# Altium schematic sheet 避障车控制板.SchDoc: 避障车控制板PCB
size A3; Revision: 1.1
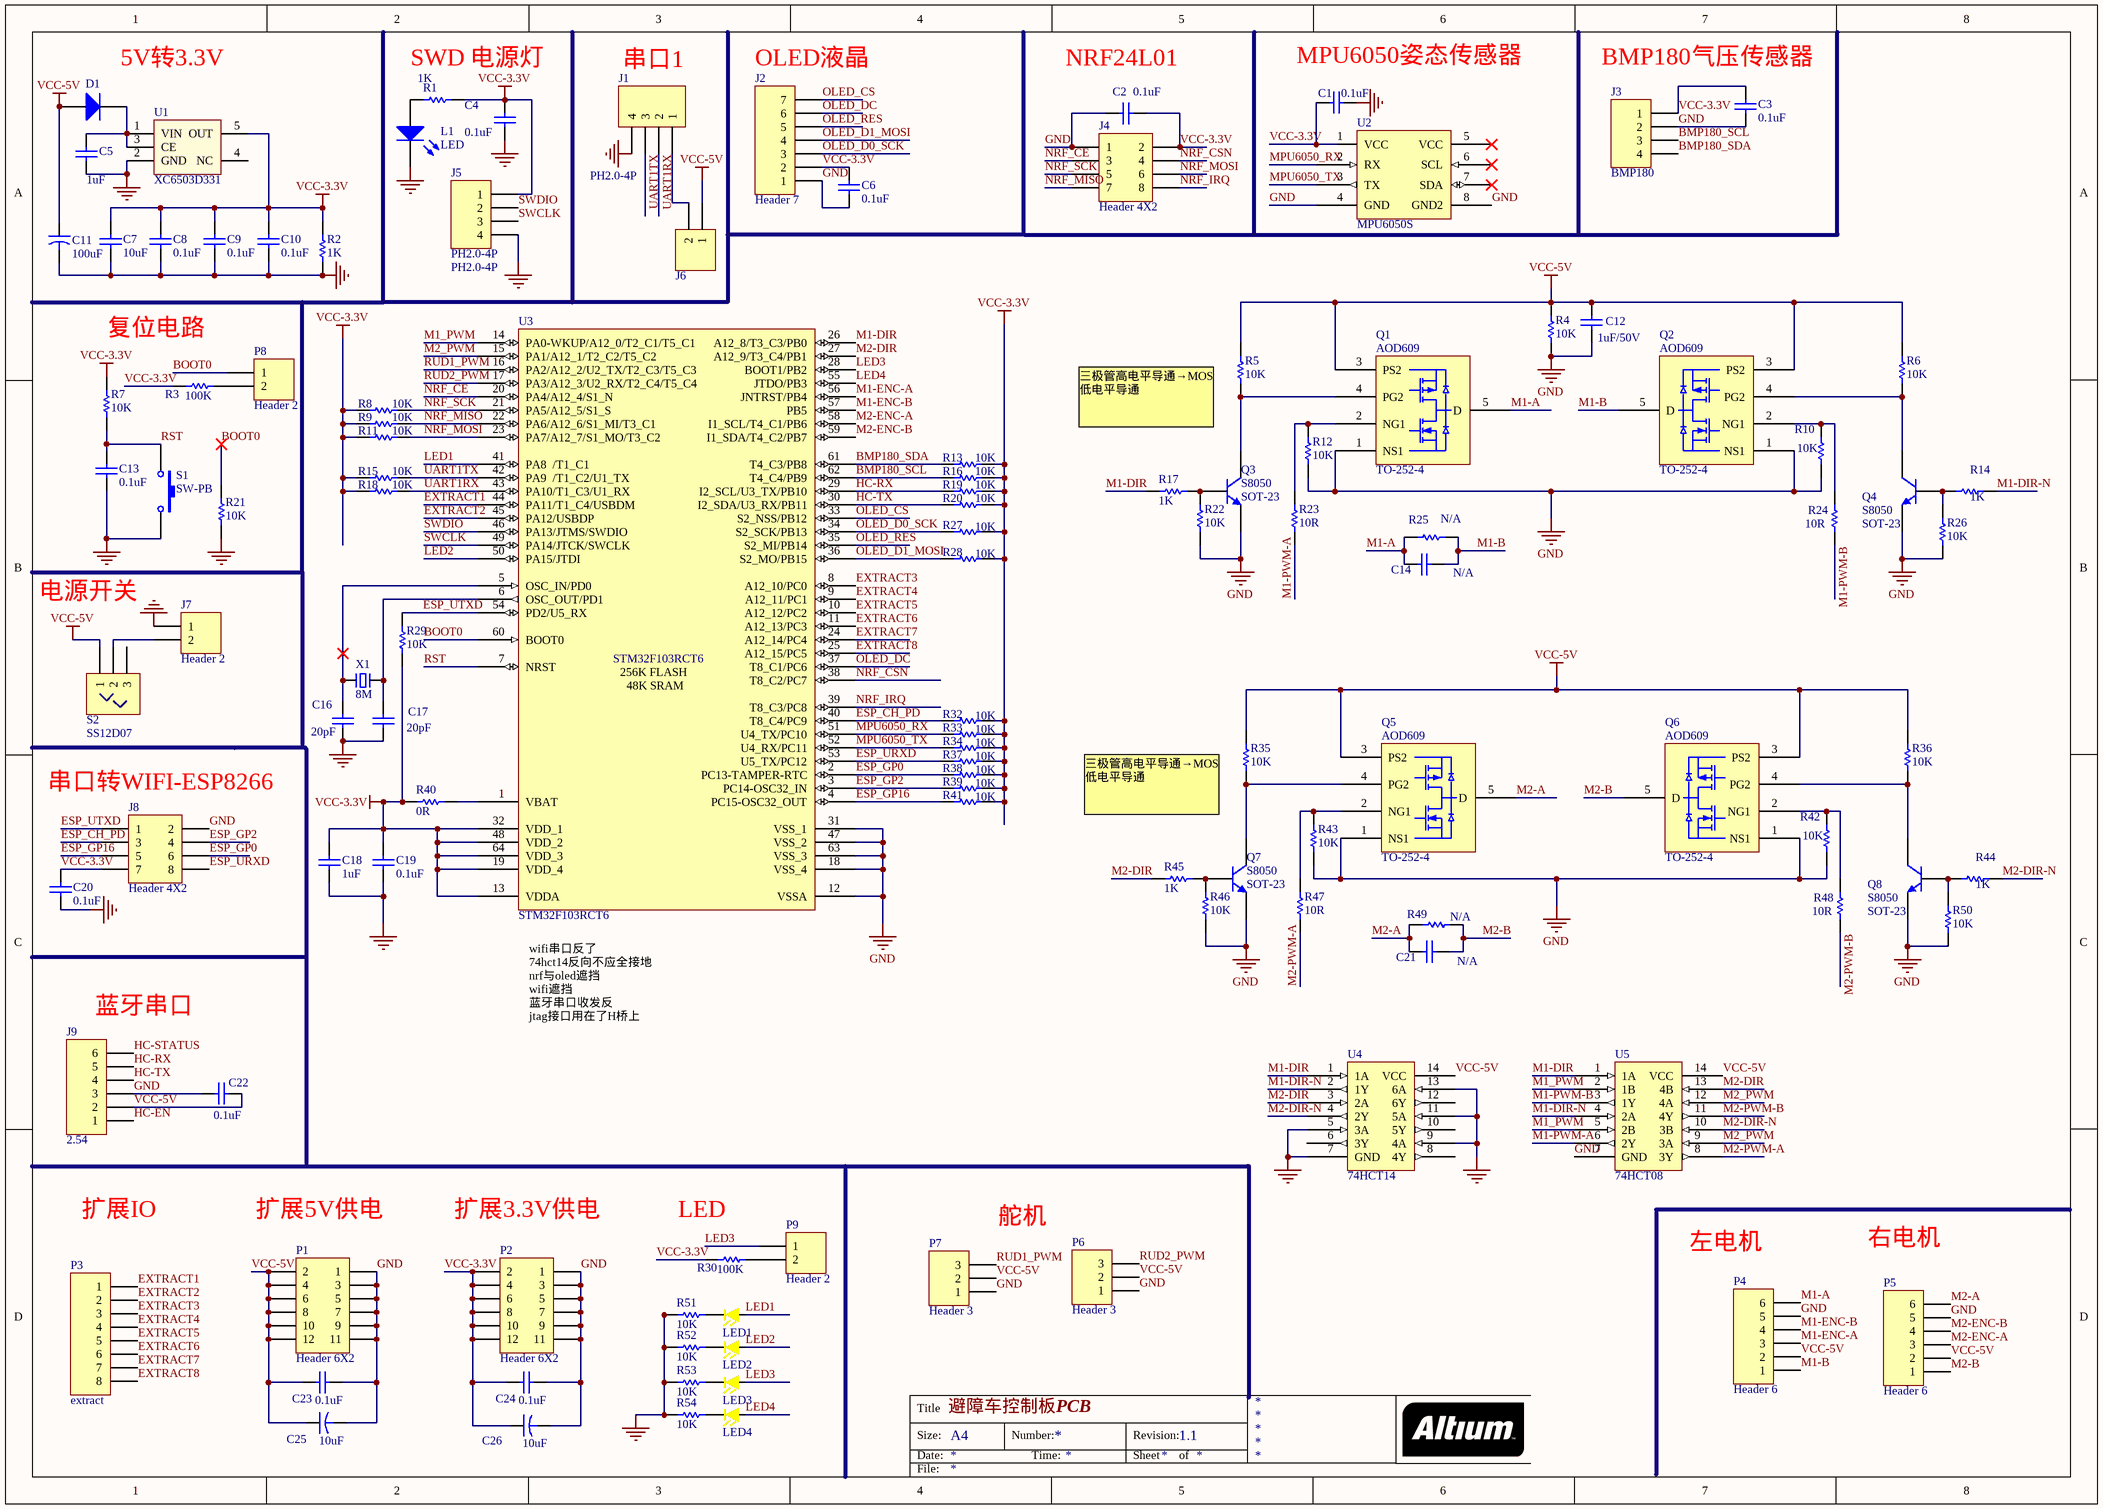
[diagram p0: 避障车控制板.SchDoc]

## Parts
C1  0.1uF  [0805_LY]
C2  0.1uF  [0805_LY]
C3  0.1uF  [0805_LY]
C4  0.1uF  [0805_LY]
C5  1uF  [0805_LY]
C6  0.1uF  [0805_LY]
C7  10uF  [0805_LY]
C8  0.1uF  [0805_LY]
C9  0.1uF  [0805_LY]
C10  0.1uF  [0805_LY]
C11  100uF  [TC6.3*7.7]
C12  1uF/50V  [0805_LY]
C13  0.1uF  [0805_LY]
C14  N/A  [0805_LY]
C16  20pF  [0805_LY]
C17  20pF  [0805_LY]
C18  1uF  [0805_LY]
C19  0.1uF  [0805_LY]
C20  0.1uF  [0805_LY]
C21  N/A  [0805_LY]
C22  0.1uF  [0805_LY]
C23  0.1uF  [0805_LY]
C24  0.1uF  [0805_LY]
C25  10uF  [TC5*5]
C26  10uF  [TC5*5]
D1  SS14  [SMA]  (value not drawn)
J1  value PH2.0-4P  [XH2.54-4P]  (hidden comment: XH2.54-4P)
J2  Header 7  [HDR1X7]
J3  value BMP180  [HDR1X4]  (hidden comment: PH2.0-4P)
J4  Header 4X2  [HDR2X4]
J5  PH2.0-4P  [PH2.0-4P]
J6  XH2.54-2P  [CAP2.54-2P]  (value not drawn)
J7  Header 2  [XH2.54-2P]
J8  Header 4X2  [HDR2X4]
J9  2.54  [HDR1X6]
L1  LED  [0805_LED]
LED1  LED-Y  [0805_LED]  (value not drawn)
LED2  LED-Y  [0805_LED]  (value not drawn)
LED3  LED-Y  [0805_LED]  (value not drawn)
LED4  LED-Y  [0805_LED]  (value not drawn)
P1  Header 6X2  [HDR2X6]
P2  Header 6X2  [HDR2X6]
P3  extract  [HDR1X8]
P4  Header 6  [PH2.0-6p]
P5  Header 6  [PH2.0-6p]
P6  Header 3  [HDR1X3]
P7  Header 3  [HDR1X3]
P8  Header 2  [HDR1X2]
P9  Header 2  [HDR1X2]
Q1  TO-252-4  value AOD609  [TO-252-4L]
Q2  TO-252-4  value AOD609  [TO-252-4L]
Q3  SOT-23  value S8050  [SOT-23_L]
Q4  SOT-23  value S8050  [SOT-23_L]
Q5  TO-252-4  value AOD609  [TO-252-4L]
Q6  TO-252-4  value AOD609  [TO-252-4L]
Q7  SOT-23  value S8050  [SOT-23_L]
Q8  SOT-23  value S8050  [SOT-23_L]
R1  1K  [0805_LY]
R2  1K  [0805_LY]
R3  100K  [6-0805_N]
R4  10K  [0805_LY]
R5  10K  [0805_LY]
R6  10K  [0805_LY]
R7  10K  [0805_LY]
R8  10K  [0805_LY]
R9  10K  [0805_LY]
R10  10K  [0805_LY]
R11  10K  [6-0805_N]
R12  10K  [0805_LY]
R13  10K  [0805_LY]
R14  1K  [0805_LY]
R15  10K  [0805_LY]
R16  10K  [0805_LY]
R17  1K  [0805_LY]
R18  10K  [0805_LY]
R19  10K  [0805_LY]
R20  10K  [0805_LY]
R21  10K  [0805_LY]
R22  10K  [0805_LY]
R23  10R  [0805_LY]
R24  10R  [0805_LY]
R25  N/A  [0805_LY]
R26  10K  [0805_LY]
R27  10K  [0805_LY]
R28  10K  [0805_LY]
R29  10K  [0805_LY]
R30  100K  [6-0805_N]
R32  10K  [0805_LY]
R33  10K  [0805_LY]
R34  10K  [0805_LY]
R35  10K  [0805_LY]
R36  10K  [0805_LY]
R37  10K  [0805_LY]
R38  10K  [0805_LY]
R39  10K  [0805_LY]
R40  0R  [0805_LY]
R41  10K  [0805_LY]
R42  10K  [0805_LY]
R43  10K  [0805_LY]
R44  1K  [0805_LY]
R45  1K  [0805_LY]
R46  10K  [0805_LY]
R47  10R  [0805_LY]
R48  10R  [0805_LY]
R49  N/A  [0805_LY]
R50  10K  [0805_LY]
R51  10K  [0805_LY]
R52  10K  [0805_LY]
R53  10K  [0805_LY]
R54  10K  [0805_LY]
S1  SW-PB  [SW-KEY]
S2  SS12D07  [SS-12D07]
U1  XC6503D331  [SOT23-5]
U2  MPU6050S  [MPU6050S]
U3  STM32F103RCT6  [LQFP64_N]
U4  74HCT14  [SO-14]
U5  74HCT08  [SO-14]
X1  8M  [HC-49SMD]

## Nets
GND: C1.2 C2.2 C3.1 C4.2 C5.1 C6.2 C7.2 C8.2 C9.1 C10.1 C11.2 C12.2 C13.2 C16.1 C17.1 C18.1 C19.1 C20.1 C22.1 C23.2 C24.2 C25.2 C26.2 J1.4 J2.1 J3.2 J4.1 J5.4 J7.1 J8.2 J9.3 L1.2(K) P1.1 P1.3 P1.5 P1.7 P1.9 P1.11 P2.1 P2.3 P2.5 P2.7 P2.9 P2.11 P4.5 P5.5 P6.1 P7.1 Q1.1(NS1) Q2.1(NS1) Q3.2(E) Q4.2(E) Q5.1(NS1) Q6.1(NS1) Q7.2(E) Q8.2(E) R2.1 R4.1 R10.2 R12.2 R21.2 R22.1 R26.2 R42.2 R43.2 R46.1 R50.2 R51.2 R52.2 R53.2 R54.2 S1.2 U1.2(GND) U2.4(GND) U2.8(GND2) U3.12(VSSA) U3.18(VSS_4) U3.31(VSS_1) U3.47(VSS_2) U3.63(VSS_3) U4.5(3A) U4.7(GND) U4.9(4A) U4.11(5A) U4.13(6A) U5.7(GND)
VCC-3.3V: C1.1 C2.1 C3.2 C4.1 C6.1 C7.1 C8.1 C9.2 C10.2 C18.2 C19.2 C20.2 C24.1 C26.1 J2.2 J3.1 J4.2 J5.1 J8.7 P2.2 P2.4 P2.6 P2.8 P2.10 P2.12 R1.2 R2.2 R3.2 R7.1 R8.1 R9.1 R11.1 R13.2 R15.1 R16.2 R18.1 R19.2 R20.2 R27.2 R28.2 R29.1 R30.2 R32.2 R33.2 R34.2 R37.2 R38.2 R39.2 R40.1 R41.2 U1.5(OUT) U2.1(VCC) U3.13(VDDA) U3.19(VDD_4) U3.32(VDD_1) U3.48(VDD_2) U3.64(VDD_3)
VCC-5V: C11.1 C12.1 C22.2 C23.1 C25.1 D1.1(A) J6.1 J9.2 P1.2 P1.4 P1.6 P1.8 P1.10 P1.12 P4.2 P5.2 P6.2 P7.2 Q1.3(PS2) Q2.3(PS2) Q5.3(PS2) Q6.3(PS2) R4.2 R5.2 R6.2 R35.2 R36.2 S2.1 U4.14(VCC) U5.14(VCC)
BMP180_SCL: J3.3 R16.1 U3.62(T4_C4/PB9)
BMP180_SDA: J3.4 R13.1 U3.61(T4_C3/PB8)
BOOT0: P8.1 R21.1 U3.60(BOOT0)
ESP_CH_PD: J8.3 R32.1 U3.40(T8_C4/PC9)
ESP_GP0: J8.6 R38.1 U3.2(PC13-TAMPER-RTC)
ESP_GP2: J8.4 R39.1 U3.3(PC14-OSC32_IN)
ESP_GP16: J8.5 R41.1 U3.4(PC15-OSC32_OUT)
ESP_URXD: J8.8 R37.1 U3.53(U5_TX/PC12)
ESP_UTXD: J8.1 R29.2 U3.54(PD2/U5_RX)
EXTRACT1: P3.1 U3.44(PA11/T1_C4/USBDM)
EXTRACT2: P3.2 U3.45(PA12/USBDP)
EXTRACT3: P3.3 U3.8(A12_10/PC0)
EXTRACT4: P3.4 U3.9(A12_11/PC1)
EXTRACT5: P3.5 U3.10(A12_12/PC2)
EXTRACT6: P3.6 U3.11(A12_13/PC3)
EXTRACT7: P3.7 U3.24(A12_14/PC4)
EXTRACT8: P3.8 U3.25(A12_15/PC5)
HC-EN: J9.1
HC-RX: J9.5 R19.1 U3.29(I2_SCL/U3_TX/PB10)
HC-STATUS: J9.6
HC-TX: J9.4 R20.1 U3.30(I2_SDA/U3_RX/PB11)
LED1: LED1.1 U3.41(PA8__/T1_C1)
LED2: LED2.1 U3.50(PA15/JTDI)
LED3: LED3.1 P9.1 U3.28(BOOT1/PB2)
LED4: LED4.1 U3.55(JTDO/PB3)
M1-A: C14.2 P4.6 Q1.5(D) R25.2
M1-B: C14.1 P4.1 Q2.5(D) R25.1
M1-DIR: R17.2 U3.26(A12_8/T3_C3/PB0) U4.1(1A) U5.1(1A)
M1-DIR-N: R14.1 U4.2(1Y) U5.4(2A)
M1-ENC-A: P4.3 U3.56(JNTRST/PB4)
M1-ENC-B: P4.4 U3.57(PB5)
M1-PWM-A: R23.2 U5.6(2Y)
M1-PWM-B: R24.2 U5.3(1Y)
M1_PWM: U3.14(PA0-WKUP/A12_0/T2_C1/T5_C1) U5.2(1B) U5.5(2B)
M2-A: C21.2 P5.6 Q5.5(D) R49.2
M2-B: C21.1 P5.1 Q6.5(D) R49.1
M2-DIR: R45.2 U3.27(A12_9/T3_C4/PB1) U4.3(2A) U5.13(4B)
M2-DIR-N: R44.1 U4.4(2Y) U5.10(3B)
M2-ENC-A: P5.3 U3.58(I1_SCL/T4_C1/PB6)
M2-ENC-B: P5.4 U3.59(I1_SDA/T4_C2/PB7)
M2-PWM-A: R47.2 U5.8(3Y)
M2-PWM-B: R48.2 U5.11(4Y)
M2_PWM: U3.15(PA1/A12_1/T2_C2/T5_C2) U5.9(3A) U5.12(4A)
MPU6050_RX: R33.1 U2.2(RX) U3.51(U4_TX/PC10)
MPU6050_TX: R34.1 U2.3(TX) U3.52(U4_RX/PC11)
NRF_CE: J4.3 U3.20(PA4/A12_4/S1_N)
NRF_CSN: J4.4 U3.38(T8_C2/PC7)
NRF_IRQ: J4.8 U3.39(T8_C3/PC8)
NRF_MISO: J4.7 R9.2 U3.22(PA6/A12_6/S1_MI/T3_C1)
NRF_MOSI: J4.6 R11.2 U3.23(PA7/A12_7/S1_MO/T3_C2)
NRF_SCK: J4.5 R8.2 U3.21(PA5/A12_5/S1_S)
OLED_CS: J2.7 U3.33(S2_NSS/PB12)
OLED_D0_SCK: J2.3 R27.1 U3.34(S2_SCK/PB13)
OLED_D1_MOSI: J2.4 R28.1 U3.36(S2_MO/PB15)
OLED_DC: J2.6 U3.37(T8_C1/PC6)
OLED_RES: J2.5 U3.35(S2_MI/PB14)
RST: C13.1 R7.2 S1.1 U3.7(NRST)
RUD1_PWM: P7.3 U3.16(PA2/A12_2/U2_TX/T2_C3/T5_C3)
RUD2_PWM: P6.3 U3.17(PA3/A12_3/U2_RX/T2_C4/T5_C4)
SWCLK: J5.3 U3.49(PA14/JTCK/SWCLK)
SWDIO: J5.2 U3.46(PA13/JTMS/SWDIO)
UART1RX: J1.2 R18.2 U3.43(PA10/T1_C3/U1_RX)
UART1TX: J1.3 R15.2 U3.42(PA9__/T1_C2/U1_TX)
NetC5_2: C5.2 D1.2(K) U1.1(VIN) U1.3(CE)
NetC16_2: C16.2 U3.5(OSC_IN/PD0) X1.2
NetC17_2: C17.2 U3.6(OSC_OUT/PD1) X1.1
NetJ1_1: J1.1 J6.2
NetJ7_2: J7.2 S2.2
NetL1_1: L1.1(A) R1.1
NetLED1_2: LED1.2 R51.1
NetLED2_2: LED2.2 R52.1
NetLED3_2: LED3.2 R53.1
NetLED4_2: LED4.2 R54.1
NetP8_2: P8.2 R3.1
NetP9_2: P9.2 R30.1
NetQ1_2: Q1.2(NG1) R12.1 R23.1
NetQ1_4: Q1.4(PG2) Q3.3(C) R5.1
NetQ2_2: Q2.2(NG1) R10.1 R24.1
NetQ2_4: Q2.4(PG2) Q4.3(C) R6.1
NetQ3_1: Q3.1(B) R17.1 R22.2
NetQ4_1: Q4.1(B) R14.2 R26.1
NetQ5_2: Q5.2(NG1) R43.1 R47.1
NetQ5_4: Q5.4(PG2) Q7.3(C) R35.1
NetQ6_2: Q6.2(NG1) R42.1 R48.1
NetQ6_4: Q6.4(PG2) Q8.3(C) R36.1
NetQ7_1: Q7.1(B) R45.1 R46.2
NetQ8_1: Q8.1(B) R44.2 R50.1
NetR40_2: R40.2 U3.1(VBAT)

Not connected (* = marked no-connect by the designer): S2 3; U1 4(NC); U2 5(VCC)* 6(SCL)* 7(SDA)*; U4 6(3Y) 8(4Y) 10(5Y) 12(6Y)

## Notes on the sheet
- 5V转3.3V
- SWD 电源灯
- (near J1) 串口1
- (near J2) OLED液晶
- (near C2) NRF24L01
- (near C1) MPU6050姿态传感器
- BMP180气压传感器
- 复位电路
- (near R5) 三极管高电平导通→MOS低电平导通
- 电源开关
- (near J8) 串口转WIFI-ESP8266
- (near R35) 三极管高电平导通→MOS低电平导通
- (near J9) 蓝牙串口
- (near U3) wifi串口反了
  74hct14反向不应全接地
  nrf与oled遮挡
  wifi遮挡
  蓝牙串口收发反
  jtag接口用在了H桥上
- 扩展IO
- (near P1) 扩展5V供电
- (near P2) 扩展3.3V供电
- (near R30) LED
- (near P7) 舵机
- 左电机
- 右电机
- Title
- Size:
- Date:
- A4
- Number:
- Time:
- Revision:
- Sheet
- of
- File:
- (in symbol STM32F103RCT6) 256K FLASH; 48K SRAM

## Library data of the parts
C1 C2 C4-C10 C12-C14 C16-C22 = Cap: Capacitor; Published: 8-Jun-2000; LatestRevisionDate: 17-Jul-2002; LatestRevisionNote: Re-released for DXP Platform.; PackageReference: RAD-0.3; Publisher: Altium Limited; PackageDescription: Radial Cap, Thru-Hole; 2 Leads; 0.3 in Pin Spacing
  C1 C2 C4 C6 C8-C10 C13 C19 C20 C22: Value: 0.1uF
  C5 C18: Value: 1uF
  C7: Value: 10uF
  C12: Value: 1uF/50V
  C14 C21: Value: N/A
  C16 C17: Value: 20pF
C3 C23 C24 = Cap: 电容0603; Published: 8-Jun-2000; LatestRevisionDate: 17-Jul-2002; LatestRevisionNote: Re-released for DXP Platform.; PackageReference: RAD-0.3; Publisher: Altium Limited; PackageDescription: Radial Cap, Thru-Hole; 2 Leads; 0.3 in Pin Spacing; Value: 0.1uF
C11 = Cap100uf: 100uf/35v电解电容; Published: 23-Sep-2002; PackageReference: CAPR5-4X5; Publisher: Altium Limited; PackageDescription: Capacitor; 2 Leads; Value: 100uF
C25 C26 = Cap10uf: 10uf/35v电解电容; Published: 23-Sep-2002; PackageReference: CAPR5-4X5; Publisher: Altium Limited; PackageDescription: Capacitor; 2 Leads; Value: 10uF
D1 = SS14: 28V 1A; Published: 8-Jun-2000; LatestRevisionDate: 17-Jul-2002; LatestRevisionNote: Re-released for DXP Platform.; PackageVersion: Sep-1996; PackageReference: SMC; Publisher: Altium Limited; PackageDescription: DO-214-AB/SMC; 2 C-Bend Leads; Body 7.9 x 5.9 mm, inc. leads (LxW); Code_JEDEC: DO-214-AB
J1 = XH2.54-4P: 插座XH2.54-4P; LatestRevisionDate: 17-Jul-2002; LatestRevisionNote: Re-released for DXP Platform.; Publisher: Altium Limited
J2 = Header 7: Header, 7-Pin; LatestRevisionDate: 17-Jul-2002; LatestRevisionNote: Re-released for DXP Platform.; Publisher: Altium Limited
J3 J5 = Header 4: Header, 4-Pin; LatestRevisionDate: 17-Jul-2002; LatestRevisionNote: Re-released for DXP Platform.; Publisher: Altium Limited
  J5: Value: PH2.0-4P
J4 J8 = Header 4X2: Header, 4-Pin, Dual row; LatestRevisionDate: 17-Jul-2002; LatestRevisionNote: Re-released for DXP Platform.; Publisher: Altium Limited
J6 = XH2.54-2P: 插座XH2.54-2P; LatestRevisionDate: 17-Jul-2002; LatestRevisionNote: Re-released for DXP Platform.; Publisher: Altium Limited
J7 P8 P9 = Header 2: Header, 2-Pin; LatestRevisionDate: 17-Jul-2002; LatestRevisionNote: Re-released for DXP Platform.; Publisher: Altium Limited
J9 P4 P5 = Header 6: Header, 6-Pin; LatestRevisionDate: 17-Jul-2002; LatestRevisionNote: Re-released for DXP Platform.; Publisher: Altium Limited
LED1-LED4 = LED-Y: LED黄0603
P1 P2 = Header 6X2: Header, 6-Pin, Dual row; LatestRevisionDate: 17-Jul-2002; LatestRevisionNote: Re-released for DXP Platform.; Publisher: Altium Limited
P3 = Header 8: Header, 8-Pin; LatestRevisionDate: 17-Jul-2002; LatestRevisionNote: Re-released for DXP Platform.; Publisher: Altium Limited
P6 P7 = Header 3: Header, 3-Pin; LatestRevisionDate: 17-Jul-2002; LatestRevisionNote: Re-released for DXP Platform.; Publisher: Altium Limited
Q1 Q2 Q5 Q6 = MOS-DUAL-N/P
Q3 Q4 Q7 Q8 = NPN: NPN Bipolar Transistor; Published: 8-Jun-2000; LatestRevisionDate: 17-Jul-2002; LatestRevisionNote: Re-released for DXP Platform.; PackageReference: TO-226-AA; Publisher: Altium Limited; PackageDescription: TO, Flat Index; 3 In-Line, Axial Leads; Body Dia. 4.8mm; Leads 0.55 x 0.51 mm (max); Code_JEDEC: TO-226-AA
R1 R2 R4-R7 R10 R12 R14 R17 R21-R26 R35 R36 R40 R42-R50 = Res1: Resistor; Published: 8-Jun-2000; LatestRevisionDate: 17-Jul-2002; LatestRevisionNote: Re-released for DXP Platform.; PackageReference: AXIAL-0.3; Publisher: Altium Limited; PackageDescription: Axial Device, Thru-Hole; 2 Leads; 0.3 in Pin Spacing
  R1 R2 R14 R17 R44 R45: Value: 1K
  R4-R7 R10 R12 R21 R22 R26 R35 R36 R42 R43 R46 R50: Value: 10K
  R23 R24 R47 R48: Value: 10R
  R25 R49: Value: N/A
  R40: Value: 0R
R3 R8 R9 R11 R13 R15 R16 R18-R20 R27-R30 R32-R34 R37-R39 R41 R51-R54 = Res: 电阻0603; Published: 8-Jun-2000; LatestRevisionDate: 17-Jul-2002; LatestRevisionNote: Re-released for DXP Platform.; PackageReference: AXIAL-0.3; Publisher: Altium Limited; PackageDescription: Axial Device, Thru-Hole; 2 Leads; 0.3 in Pin Spacing
  R3 R30: Value: 100K
  R8 R9 R11 R13 R15 R16 R18-R20 R27-R29 R32-R34 R37-R39 R41 R51-R54: Value: 10K
S1 = SW-PB: Switch; Published: 24-Mar-1999; LatestRevisionDate: 17-Jul-2002; LatestRevisionNote: Re-released for DXP Platform.; PackageReference: SPST-2; Publisher: Altium Limited; PackageDescription: Switch; 2 Leads
U1 = XC6503Dxxx: Value: XC6503D331
U3 = STM32F103RCT6: 256K Flash 48K RAM; Published: 30-May-2008; DatasheetVersion: rev6, Mar-2008; PackageVersion: Mar-2008; PackageReference: LQFP64; Publisher: Altium Limited; PackageDescription: 64-Pin Low-Profile Quad Flat Pack, 10 x 10 mm Body, 0.5 mm Pitch (LQFP64); ComponentLink1Description: Manufacturer Link; ComponentLink1URL: www.st.com/stm32; ComponentLink2Description: Datasheet; ComponentLink2URL: http://www.st.com/stonline/products/literature/ds/13587.pdf
U4 = 74HCT14: 反向输出 AL-YH,AH-YL
U5 = 74HCT08: 与门AH&&BH?YH:YL
X1 = XTAL: Value: HC-49SMD
S2 = SS12D07: Value: SS12D07